# Altium schematic sheet ID1.SchDoc: ZoZbot Upper Main Board - ID1
size B; Author: RMG; Organization: OLogic, Inc.; DocumentNumber: UMB2; Revision: B; SheetNumber: 2; SheetTotal: 2; PageSetup: Record=PageOptions|CenterHorizontal=True|CenterVertical=True|PrintScale=0.70|XCorrection=1.00|YCorrection=1.00|PrintKind=0|BorderSize=5000000|LeftOffset=0|BottomOffset=0|Orientation=2|PaperLength=1000|PaperWidth=1000|Scale=100|PaperSource=15|PrintQuality=600|MediaType=1|DitherType=10|PrintScaleMode=1|PaperKind=Letter|PaperIndex=1
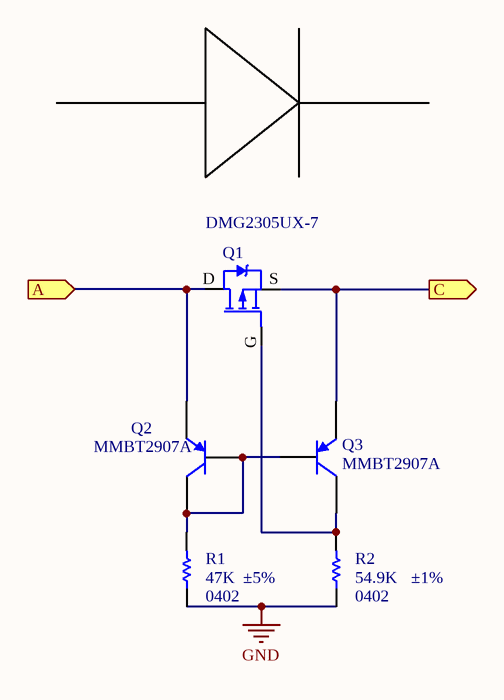
[diagram p0: ID1.SchDoc]

## Parts
Q1  DMG2305UX  [DMG2305UX-7]  (value not drawn)
Q2  MMBT2907A  [SOT23]
Q3  MMBT2907A  [SOT23]
R1  47K  Tolerance: ±5%  Supplier Device Package: 0402  [RESC0402(1005)_N]
R2  54.9K  Tolerance: ±1%  Supplier Device Package: 0402  [RESC0402(1005)_N]

## Ports
A (in), C (out)

## Nets
GND: R1.1 R2.1
A: Q1.D Q2.2(E) ; port A
C: Q1.S Q3.2(E) ; port C
NetQ1_G: Q1.G Q3.3(C) R2.2
NetQ2_1: Q2.1(B) Q2.3(C) Q3.1(B) R1.2

## Notes on the sheet
- Title
- By:
- Date:
- Number:
- Time:
- Revision:
- Sheet
- of
- OLogic, Inc.
- 1394 Borregas Ave.
- Sunnyvale, CA
- 94089 USA
- File:
- (650) 996-1490

## Library data of the parts
Q1 = DMG2305UX: MOSFET P-CH 20V 4.2A SOT23; Manufacturer: Diodes Incorporated; FET Type: MOSFET P-Channel, Metal Oxide; FET Feature: Standard; Current - Continuous Drain (Id) @ 25°C: 4.2A (Ta); Rds On (Max) @ Id, Vgs: 52 mOhm @ 4.2A, 4.5V; Vgs(th) (Max) @ Id: 900mV @ 250µA; Gate Charge (Qg) @ Vgs: 10.2nC @ 4.5V; Input Capacitance (Ciss) @ Vds: 808pF @ 15V; Power - Max: 1.4W; Supplier 1: Digi-Key; RoHS: RoHS Compliant; Category: Discrete Semiconductor Products; Stock 1: 78669; Pricing 1: 1=0.38, 10=0.311, 100=0.1649, 500=0.10846, 1000=0.0739 (USD); Packaging: Cut Tape (CT); Drain to Source Voltage (Vdss): 20V; Operating Temperature: -55°C ~ 150°C (TJ); Mounting Type: Surface Mount; Package / Case: TO-236-3, SC-59, SOT-23-3; Supplier Device Package: SOT-23; ComponentLink1URL: http://www.diodes.com/_files/datasheets/DMG2305UX.pdf; ComponentLink1Description: http://www.diodes.com/_files/datasheets/DMG2305UX.pdf; Supplier Part Number 1: DMG2305UX-7DICT-ND; Creator: osman; Manufacturer Part Number: DMG2305UX-7
Q2 Q3 = MMBT2907A: PNP General Purpose Amplifier; Manufacturer: Fairchild Semiconductor; Vendor: Digikey; PN: MMBT2907AFSCT-ND; Current - Collector (Ic) (Max): 800mA; Voltage - Collector Emitter Breakdown (Max): 60V; Vce Saturation (Max) @ Ib, Ic: 1.6V @ 50mA, 500mA; DC Current Gain (hFE) (Min) @ Ic, Vce: 100 @ 150mA, 10V; Power - Max: 350mW; Frequency - Transition: 200MHz; MPN: MMBT2907A; Supplier 1: Digi-Key; Manufacturer Part Number: MMBT2907A; RoHS: RoHS Compliant; Category: Discrete Semiconductor Products; Stock 1: 74892; Pricing 1: 1=0.2, 10=0.187, 25=0.17, 100=0.1224, 250=0.07208, 500=0.0598, 1000=0.04079 (USD); Packaging: Cut Tape (CT); Transistor Type: PNP; Current - Collector Cutoff (Max): -; Mounting Type: Surface Mount; Package / Case: TO-236-3, SC-59, SOT-23-3; Supplier Device Package: SOT-23; ComponentLink1URL: http://www.fairchildsemi.com/ds/MM/MMBT2907A.pdf; ComponentLink1Description: http://www.fairchildsemi.com/ds/MM/MMBT2907A.pdf; Supplier Part Number 1: MMBT2907AFSCT-ND
R1 = RES 47K OHM 5% 1/10W 0402: 47K 0402; Manufacturer: Panasonic Electronic Components; Manufacturer Part Number: ERJ-2GEJ473X; Power (Watts): 0.1W, 1/10W; Temperature Coefficient: ±200ppm/°C; Supplier 1: Digi-Key; RoHS: RoHS Compliant; Category: Resistors; Stock 1: 1670564; Pricing 1: 1=0.1, 50=0.0106, 100=0.0078, 250=0.00596, 500=0.00476, 1000=0.0035, 5000=0.00251 (USD); Packaging: Cut Tape (CT); Resistance (Ohms): 47k; Composition: Thick Film; Features: Automotive AEC-Q200; Operating Temperature: -55°C ~ 155°C; Package / Case: 0402 (1005 Metric); Size / Dimension: 0.039" L x 0.020" W (1.00mm x 0.50mm); Height: 0.016" (0.40mm); Number of Terminations: 2; ComponentLink1URL: http://industrial.panasonic.com/www-cgi/jvcr13pz.cgi?E+PZ+3+AOA0001+ERJ2GEJ473X+7+WW; ComponentLink1Description: http://industrial.panasonic.com/www-cgi/jvcr13pz.cgi?E+PZ+3+AOA0001+ERJ2GEJ473X+7+WW; Supplier Part Number 1: P47KJCT-ND
R2 = RES 54.9K OHM 1% 1/10W 0402: 54.9K 1% 0402; Manufacturer: Panasonic Electronic Components; Manufacturer Part Number: ERJ-2RKF5492X; Power (Watts): 0.1W, 1/10W; Temperature Coefficient: ±100ppm/°C; Supplier 1: Digi-Key; RoHS: RoHS Compliant; Category: Resistors; Stock 1: 151111; Pricing 1: 1=0.1, 50=0.015, 100=0.011, 250=0.0084, 500=0.00674, 1000=0.00496, 5000=0.00355 (USD); Packaging: Cut Tape (CT); Part Status: Active; Resistance (Ohms): 54.9k; Composition: Thick Film; Features: Automotive AEC-Q200; Operating Temperature: -55°C ~ 155°C; Package / Case: 0402 (1005 Metric); Size / Dimension: 0.039" L x 0.020" W (1.00mm x 0.50mm); Height - Seated (Max): 0.016" (0.40mm); Number of Terminations: 2; Failure Rate: -; ComponentLink1URL: http://industrial.panasonic.com/www-cgi/jvcr13pz.cgi?E+PZ+3+AOA0002+ERJ2RKF5492X+7+WW; ComponentLink1Description: http://industrial.panasonic.com/www-cgi/jvcr13pz.cgi?E+PZ+3+AOA0002+ERJ2RKF5492X+7+WW; Supplier Part Number 1: P54.9KLCT-ND